# EAGLE design Thinkpad380ED (EAGLE 9.5.0)
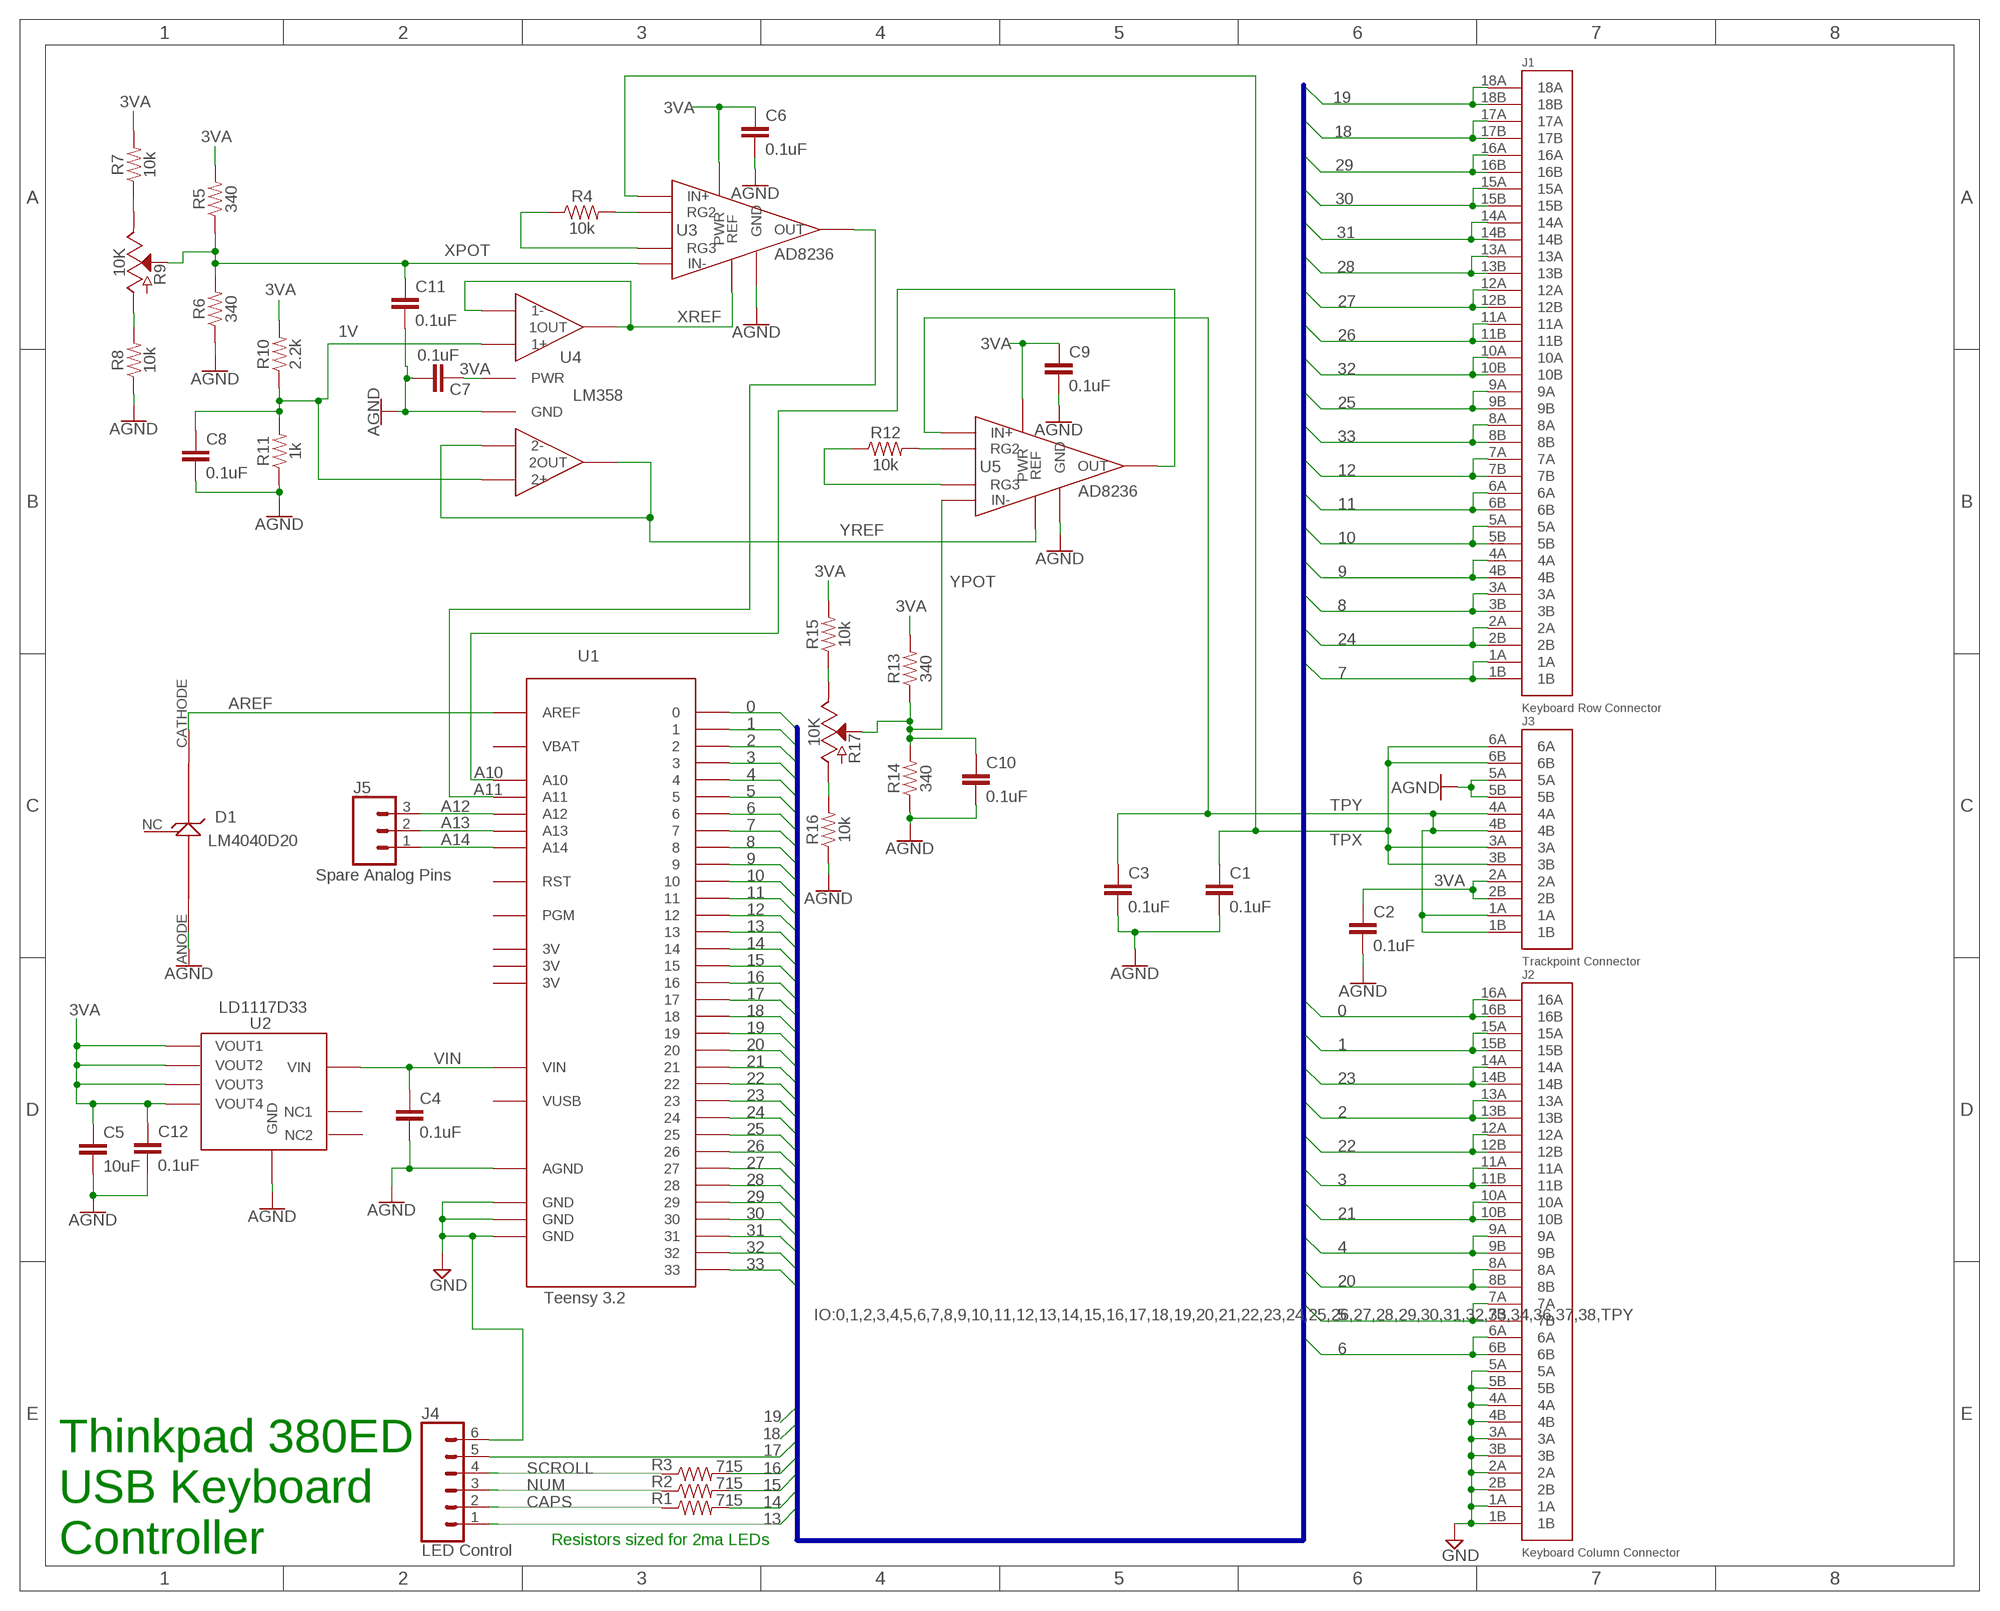
[diagram p0: schematic, sheet 1]

## Parts
C1  0.1uF  0.1UF-0603-25V-(+80/-20%)  [0603]
C2  0.1uF  0.1UF-0603-25V-(+80/-20%)  [0603]
C3  0.1uF  0.1UF-0603-25V-(+80/-20%)  [0603]
C4  0.1uF  0.1UF-0603-25V-(+80/-20%)  [0603]
C5  10uF  10UF-0603-6.3V-20%  [0603]
C6  0.1uF  0.1UF-0603-25V-(+80/-20%)  [0603]
C7  0.1uF  0.1UF-0603-25V-(+80/-20%)  [0603]
C8  0.1uF  0.1UF-0603-25V-(+80/-20%)  [0603]
C9  0.1uF  0.1UF-0603-25V-(+80/-20%)  [0603]
C10  0.1uF  0.1UF-0603-25V-(+80/-20%)  [0603]
C11  0.1uF  0.1UF-0603-25V-(+80/-20%)  [0603]
C12  0.1uF  0.1UF-0603-25V-(+80/-20%)  [0603]
D1  LM4040D20  LM4040  [LM4040]
J1  Keyboard Row Connector  0526101833  [0526101833]
J2  Keyboard Column Connector  0526101633  [0526101633]
J3  Trackpoint Connector  0526100633  [0526100633]
J4  LED Control  CONN_06SILK_FEMALE_PTH  [1X06]
J5  Spare Analog Pins  CONN_03  [1X03]
R1  715  715OHM-0603-1/10W-1%  [0603]
R2  715  715OHM-0603-1/10W-1%  [0603]
R3  715  715OHM-0603-1/10W-1%  [0603]
R4  10k  10KOHM-0603-1/10W-1%  [0603]
R5  340  340OHM-0603-1/10W-1%  [0603]
R6  340  340OHM-0603-1/10W-1%  [0603]
R7  10k  10KOHM-0603-1/10W-1%  [0603]
R8  10k  10KOHM-0603-1/10W-1%  [0603]
R9  10K  3296W-1-103LF  [3296W-1-103LF]
R10  2.2k  2.2KOHM-0603-1/10W-1%  [0603]
R11  1k  1KOHM-0603-1/10W-1%  [0603]
R12  10k  10KOHM-0603-1/10W-1%  [0603]
R13  340  340OHM-0603-1/10W-1%  [0603]
R14  340  340OHM-0603-1/10W-1%  [0603]
R15  10k  10KOHM-0603-1/10W-1%  [0603]
R16  10k  10KOHM-0603-1/10W-1%  [0603]
R17  10K  3296W-1-103LF  [3296W-1-103LF]
U1  Teensy 3.2  TEENSY_3P2  [TEENSY_3P2]
U2  LD1117D33  LD1117D33CTR  [LD1117D33CTR]
U3  AD8236  [AD8236]
U4  LM358  LM358D  [LM358D]
U5  AD8236  [AD8236]

## Nets
0: J2.16A J2.16B U1.0
1: J2.15A J2.15B U1.1
1V: C8.1 R10.1 R11.2 U4.IN1+(1+) U4.IN2+(2+)
2: J2.13A J2.13B U1.2
3: J2.11A J2.11B U1.3
3VA: C2.1 C5.1 C6.1 C7.1 C9.1 C12.1 J3.2A J3.2B R5.2 R7.2 R10.2 R13.2 R15.2 U2.VOUT1 U2.VOUT2 U2.VOUT3 U2.VOUT4 U3.PWR U4.PWR U5.PWR
4: J2.9A J2.9B U1.4
5: J2.7A J2.7B U1.5
6: J2.6A J2.6B U1.6
7: J1.1A J1.1B U1.7
8: J1.3A J1.3B U1.8
9: J1.4A J1.4B U1.9
10: J1.5A J1.5B U1.10
11: J1.6A J1.6B U1.11
12: J1.7A J1.7B U1.12
13: J4.1 U1.13
14: R1.2 U1.14
15: R2.2 U1.15
16: R3.2 U1.16
17: J4.5 U1.17
18: J1.17A J1.17B U1.18
19: J1.18A J1.18B U1.19
20: J2.8A J2.8B U1.20
21: J2.10A J2.10B U1.21
22: J2.12A J2.12B U1.22
23: J2.14A J2.14B U1.23
24: J1.2A J1.2B U1.24
25: J1.9A J1.9B U1.25
26: J1.11A J1.11B U1.26
27: J1.12A J1.12B U1.27
28: J1.13A J1.13B U1.28
29: J1.16A J1.16B U1.29
30: J1.15A J1.15B U1.30
31: J1.14A J1.14B U1.31
32: J1.10A J1.10B U1.32
33: J1.8A J1.8B U1.33
A10: U1.A10 U5.VOUT(OUT)
A11: U1.A11 U3.VOUT(OUT)
A12: J5.3 U1.A12
A13: J5.2 U1.A13
A14: J5.1 U1.A14
AGND: C1.2 C2.2 C3.2 C4.2 C5.2 C6.2 C7.2 C8.2 C9.2 C10.2 C11.2 C12.2 D1.ANODE J3.5A J3.5B R6.1 R8.1 R11.1 R14.1 R16.1 U1.AGND U2.GND U3.GND U4.GND U5.GND
AREF: D1.CATHODE U1.AREF
CAPS: J4.2 R1.1
GND: J2.1A J2.1B J2.2A J2.2B J2.3A J2.3B J2.4A J2.4B J2.5A J2.5B J4.6 U1.GND1(GND) U1.GND2(GND) U1.GND3(GND)
N$1: R4.2 U3.RG2
N$4: R4.1 U3.RG3
N$7: R8.2 R9.A
N$9: R7.1 R9.E
N$14: R12.2 U5.RG2
N$15: R12.1 U5.RG3
N$18: R16.2 R17.A
N$19: R15.1 R17.E
NUM: J4.3 R2.1
SCROLL: J4.4 R3.1
TPX: C1.1 J3.3A J3.3B J3.6A J3.6B U3.IN+
TPY: C3.1 J3.1A J3.1B J3.4A J3.4B U5.IN+
VIN: C4.1 U1.VIN U2.VIN
XPOT: C11.1 R5.1 R6.2 R9.S U3.IN-
XREF: U3.REF U4.IN1-(1-) U4.OUT1(1OUT)
YPOT: C10.1 R13.1 R14.2 R17.S U5.IN-
YREF: U4.IN2-(2-) U4.OUT2(2OUT) U5.REF
Unconnected: D1.NC U1.3V1(3V) U1.3V2(3V) U1.3V3(3V) U1.PGM U1.RST U1.VBAT U1.VUSB U2.NC1 U2.NC2

## Buses
IO:0,1,2,3,4,5,6,7,8,9,10,11,12,13,14,15,16,17,18,19,20,21,22,23,24,25,26,27,28,29,30,31,32,33,34,36,37,38,TPY

## Notes on the sheet
- Resistors sized for 2ma LEDs
- Thinkpad 380ED 
  USB Keyboard 
  Controller

## Library data of the parts
C1-C4 C6-C12 = SparkFun-Capacitors:0.1UF: 0.1µF ceramic capacitors A capacitor is a passive two-terminal electrical component used to store electrical energy temporarily in an electric field.; PROD_ID: CAP-00810
C5 = SparkFun-Capacitors:10UF: 10.0µF ceramic capacitors A capacitor is a passive two-terminal electrical component used to store electrical energy temporarily in an electric field.; PROD_ID: CAP-11015
D1 = LM4040:LM4040
J1 = 0526101833:0526101833
J2 = 0526101633:0526101633
J3 = 0526100633:0526100633
J4 = SparkFun-Connectors:CONN_06: Multi connection point. Often used as Generic Header-pin footprint for 0.1 inch spaced/style header connections On any of the 0.1 inch spaced packages, you can populate with these: Break Away Headers - Straight <https://www.sparkfun.com/products/116> (PRT-00116) Break Away Male Headers - Right Angle <https://www.sparkfun.com/products/553> (PRT-00553) Female Headers <https://www.sparkfun.com/products/115> (PRT-00115) Break Away Headers - Machine Pin <https://www.sparkfun.com/products/117> (PRT-00117) Break Away Female Headers - Swiss Machine Pin <https://www.sparkfun.com/products/743> (PRT-00743) Arduino Stackable Header - 6 Pin <https://www.sparkfun.com/products/9280> (PRT-09280) For SCREWTERMINALS and SPRING TERMINALS visit here: Screw Terimnals on SparkFun.com <https://www.sparkfun.com/search/results?term=Screw+Terminals> (5mm/3.5mm/2.54mm spacing) This device is also useful as a general connection point to wire up your design to another part of your project. Our various solder wires solder well into these plated through hole pads. Hook-Up Wire - Assortment (Stranded, 22 AWG) <https://www.sparkfun.com/products/11375> (PRT-11375) Hook-Up Wire - Assortment (Solid Core, 22 AWG) <https://www.sparkfun.com/products/11367> (PRT-11367) View the entire wire category on our website here <https://www.sparkfun.com/categories/141>; PROD_ID: CONN-08437
J5 = SparkFun-Connectors:CONN_03: Multi connection point. Often used as Generic Header-pin footprint for 0.1 inch spaced/style header connections On any of the 0.1 inch spaced packages, you can populate with these: Break Away Headers - Straight <https://www.sparkfun.com/products/116> (PRT-00116) Break Away Male Headers - Right Angle <https://www.sparkfun.com/products/553> (PRT-00553) Female Headers <https://www.sparkfun.com/products/115> (PRT-00115) Break Away Headers - Machine Pin <https://www.sparkfun.com/products/117> (PRT-00117) Break Away Female Headers - Swiss Machine Pin <https://www.sparkfun.com/products/743> (PRT-00743) Stackable Header - 3 Pin (Female, 0.1") <https://www.sparkfun.com/products/13875> (PRT-13875) For SCREWTERMINALS and SPRING TERMINALS visit here: Screw Terimnals on SparkFun.com <https://www.sparkfun.com/search/results?term=Screw+Terminals> (5mm/3.5mm/2.54mm spacing) This device is also useful as a general connection point to wire up your design to another part of your project. Our various solder wires solder well into these plated through hole pads. Hook-Up Wire - Assortment (Stranded, 22 AWG) <https://www.sparkfun.com/products/11375> (PRT-11375) Hook-Up Wire - Assortment (Solid Core, 22 AWG) <https://www.sparkfun.com/products/11367> (PRT-11367) View the entire wire category on our website here <https://www.sparkfun.com/categories/141> Special notes: Molex polarized connector foot print use with SKU : PRT-08232 with associated crimp pins and housings.; PROD_ID: XXX-00000; VALUE: 455-1750-1-ND
R1-R3 = SparkFun-Resistors:715OHM: 715Ω resistor A resistor is a passive two-terminal electrical component that implements electrical resistance as a circuit element. Resistors act to reduce current flow, and, at the same time, act to lower voltage levels within circuits. - Wikipedia; PROD_ID: RES-07850
R4 R7 R8 R12 R15 R16 = SparkFun-Resistors:10KOHM: 10kΩ resistor A resistor is a passive two-terminal electrical component that implements electrical resistance as a circuit element. Resistors act to reduce current flow, and, at the same time, act to lower voltage levels within circuits. - Wikipedia; PROD_ID: RES-00824
R5 R6 R13 R14 = SparkFun-Resistors:340OHM: 340Ω resistor A resistor is a passive two-terminal electrical component that implements electrical resistance as a circuit element. Resistors act to reduce current flow, and, at the same time, act to lower voltage levels within circuits. - Wikipedia; PROD_ID: RES-12616
R9 R17 = 3296W-1-103LF:3296W-1-103LF
R10 = SparkFun-Resistors:2.2KOHM: 2.2kΩ resistor A resistor is a passive two-terminal electrical component that implements electrical resistance as a circuit element. Resistors act to reduce current flow, and, at the same time, act to lower voltage levels within circuits. - Wikipedia; PROD_ID: RES-08272
R11 = SparkFun-Resistors:1KOHM: 1kΩ resistor A resistor is a passive two-terminal electrical component that implements electrical resistance as a circuit element. Resistors act to reduce current flow, and, at the same time, act to lower voltage levels within circuits. - Wikipedia; PROD_ID: RES-07856
U1 = Teensy_3p2_PCG:TEENSY_3P2: Teensy 3.2 - Microcontroller Technical Specifications: VCC: 3.3V signals, 5V tolerant 72 MHz Cortex-M4 32 bit ARM Processor 100% Compatible with Teensy 3.1 pjrc.com/store/teensy32.html
U2 = LD1117D33CTR:LD1117D33CTR
U3 U5 = AD8236:AD8236
U4 = LM358D:LM358D

## Board
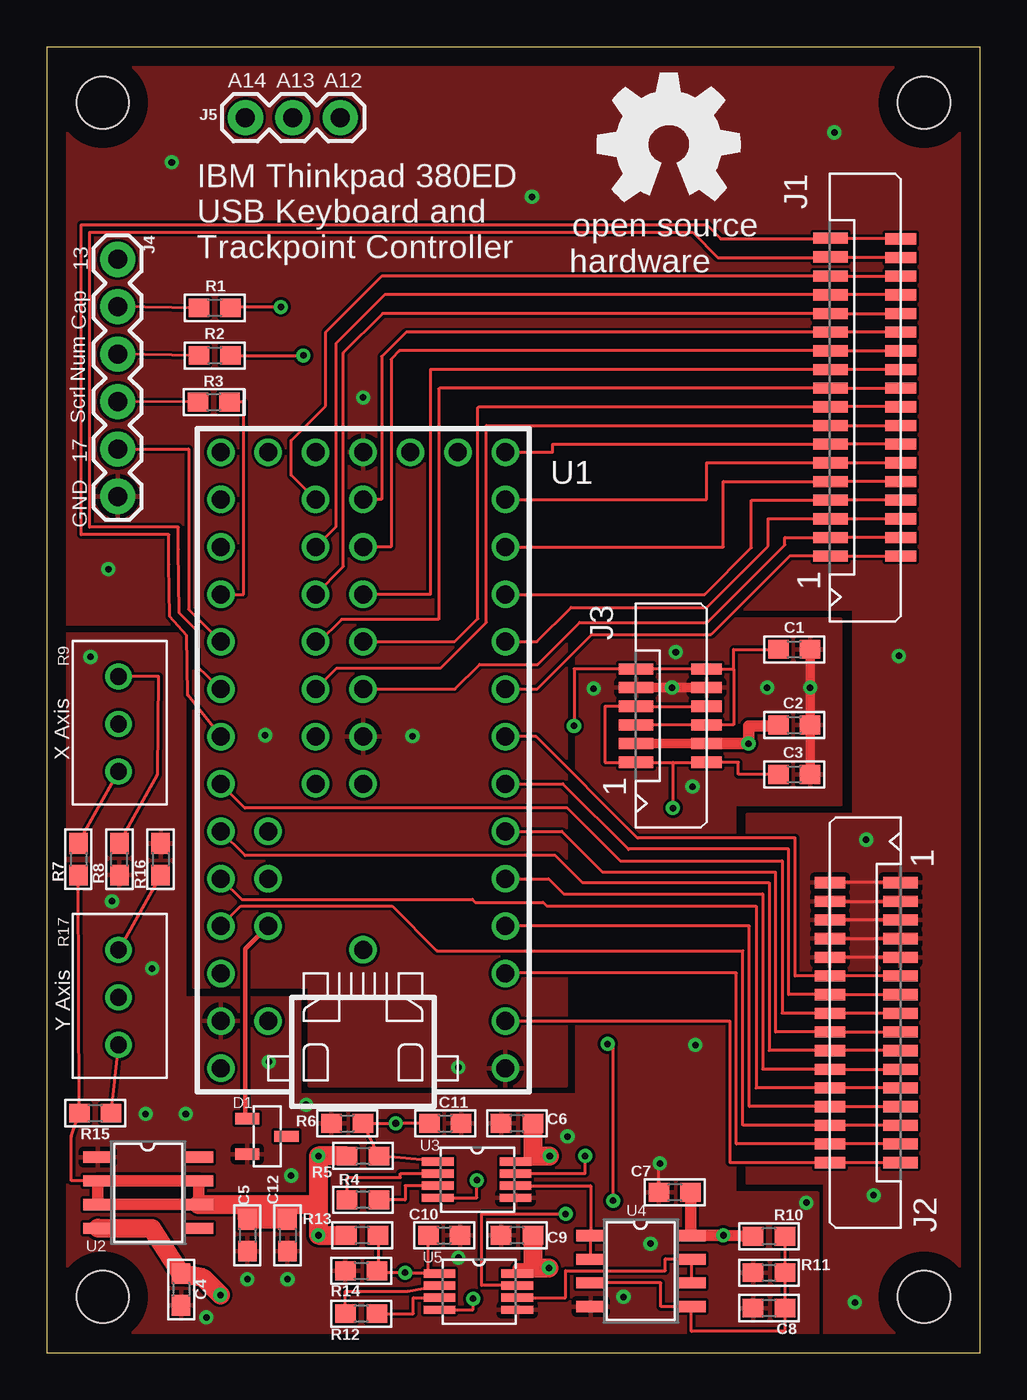
[diagram p1: board, top side]
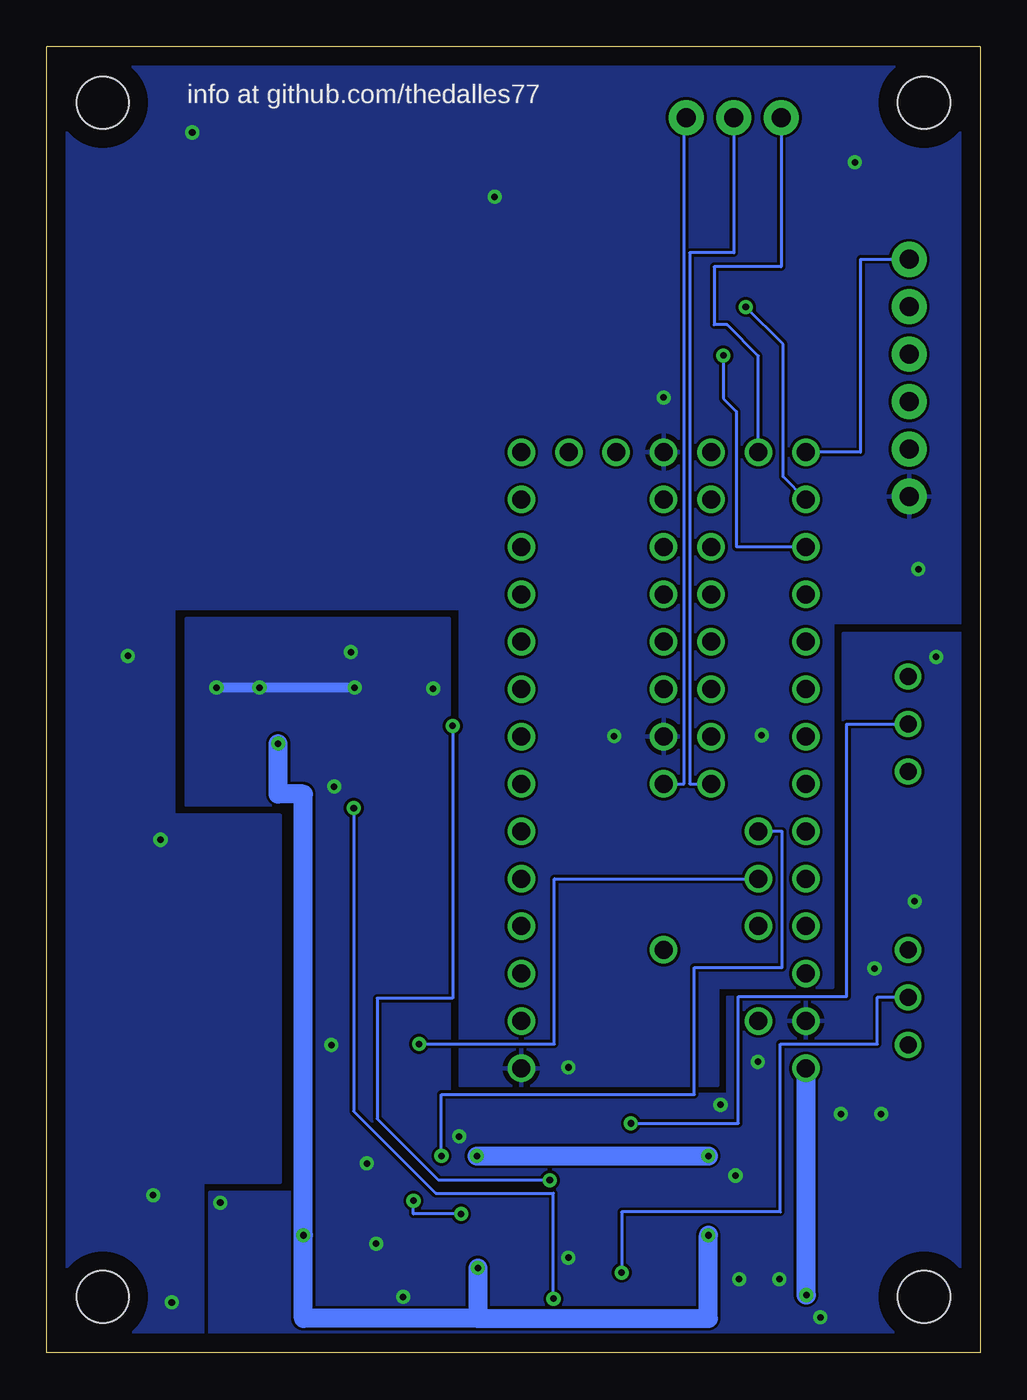
[diagram p2: board, bottom side, seen from below]

Size 50 x 70 mm. Coordinates in mm from the lower left corner, seen from the top.
Outline: 0,0 50,0 50,70 0,70 0,0
Copper layers (1*16): Top 0.035mm / dielectric 1.5mm / Bottom 0.035mm
Design rules "default": minimum track width 6mil, minimum drill 0.35mm, track to track 6mil, track to pad 6mil, pad to pad 6mil, via to via 6mil, smd to smd 6mil, copper to edge 40mil, drill to drill 6mil, minimum pad ring 10mil, minimum via ring 8mil, stop-mask expansion 4mil, vias tented up to drill 0mil, thermal gap 10mil
Holes 2.8 mm at 3,3 47,3 47,67 3,67

### Footprints (pad centres in the part's own frame; a part is rotated, then mirrored left to right if it is on the bottom)
0603 = smd 1.1 x 1: 1 -0.85,0; 2 0.85,0
LM4040 = smd 1.3 x 0.6: ANODE -1.1,-0.95; CATHODE -1.1,0.95; NC 1,0
0526101833 = smd 0.6 x 1.65: 1A 0,0; 2A 1,0; 3A 2,0; 4A 3,0; 5A 4,0; 6A 5,0; 7A 6,0; 8A 7,0; 9A 8,0; 10A 9,0; 11A 10,0; 12A 11,0; 13A 12,0; 14A 13,0; 15A 14,0; 16A 15,0; 17A 16,0; 18A 17,0 | smd 0.6 x 1.85: 1B 0,3.77; 2B 1,3.77; 3B 2,3.77; 4B 3,3.77; 5B 4,3.77; 6B 5,3.77; 7B 6,3.77; 8B 7,3.77; 9B 8,3.77; 10B 9,3.77; 11B 10,3.77; 12B 11,3.77; 13B 12,3.77; 14B 13,3.77; 15B 14,3.77; 16B 15,3.77; 17B 16.03,3.76; 18B 17.03,3.76
0526101633 = smd 0.6 x 1.65: 1A 0,0; 2A 1,0; 3A 2,0; 4A 3,0; 5A 4,0; 6A 5,0; 7A 6,0; 8A 7,0; 9A 8,0; 10A 9,0; 11A 10,0; 12A 11,0; 13A 12,0; 14A 13,0; 15A 14,0; 16A 15,0 | smd 0.6 x 1.85: 1B 0,3.77; 2B 1,3.77; 3B 2,3.77; 4B 3,3.77; 5B 4,3.77; 6B 5,3.77; 7B 6,3.77; 8B 7,3.77; 9B 8,3.77; 10B 9,3.77; 11B 10,3.77; 12B 11,3.77; 13B 12,3.77; 14B 13,3.77; 15B 14,3.77; 16B 15,3.77
0526100633 = smd 0.6 x 1.65: 1A 0,0; 2A 1,0; 3A 2,0; 4A 3,0; 5A 4,0; 6A 5,0 | smd 0.6 x 1.85: 1B 0,3.77; 2B 1,3.77; 3B 2,3.77; 4B 3,3.77; 5B 4,3.77; 6B 5,3.77
1X06 = drill 1.016 pad 1.88: 1 0,0; 2 2.54,0; 3 5.08,0; 4 7.62,0; 5 10.16,0; 6 12.7,0
1X03 = drill 1.016 pad 1.88: 1 0,0; 2 2.54,0; 3 5.08,0
3296W-1-103LF = drill 0.9: A 0,2.54; E 0,-2.54; S 0,0
TEENSY_3P2 = drill 0.965: 0 -10.16,-7.62; 1 -7.62,-7.62; 2 -5.08,-7.62; 3 -2.54,-7.62; 3V1 -7.62,7.62; 3V2 20.32,-2.54; 3V3 5.08,2.54; 4 0,-7.62; 5 2.54,-7.62; 6 5.08,-7.62; 7 7.62,-7.62; 8 10.16,-7.62; 9 12.7,-7.62; 10 15.24,-7.62; 11 17.78,-7.62; 12 20.32,-7.62; 13 20.32,7.62; 14 17.78,7.62; 15 15.24,7.62; 16 12.7,7.62; 17 10.16,7.62; 18 7.62,7.62; 19 5.08,7.62; 20 2.54,7.62; 21 0,7.62; 22 -2.54,7.62; 23 -5.08,7.62; 24 7.62,0; 25 10.16,0; 26 12.7,0; 27 15.24,0; 28 17.78,0; 29 17.78,2.54; 30 15.24,2.54; 31 12.7,2.54; 32 10.16,2.54; 33 7.62,2.54; A10 -2.54,5.08; A11 0,5.08; A12 2.54,0; A13 2.54,2.54; A14 20.32,5.08; AGND -10.16,7.62; AREF -5.08,5.08; GND1 -12.7,-7.62; GND2 20.32,0; GND3 5.08,0; PGM 20.32,2.54; RST -6.35,0; VBAT 20.32,-5.08; VIN -12.7,7.62; VUSB -10.16,5.08
LD1117D33CTR = smd 1.55 x 0.6: GND -2.66,1.84; NC1 2.74,1.84; NC2 2.74,-1.97; VIN -2.66,-1.97; VOUT1 -2.66,0.57; VOUT2 -2.66,-0.7; VOUT3 2.74,0.57; VOUT4 2.74,-0.7
AD8236 = smd 1.7 x 0.45: GND 2.06,-0.99; IN+ -2.1,-0.99; IN- -2.1,0.96; PWR 2.06,0.96; REF 2.06,-0.34; RG2 -2.1,0.31; RG3 -2.1,-0.34; VOUT 2.06,0.31
LM358D = smd 1.55 x 0.6: GND -2.66,-1.97; IN1+ -2.66,-0.7; IN1- -2.66,0.57; IN2+ 2.74,-1.97; IN2- 2.74,-0.7; OUT1 -2.66,1.84; OUT2 2.74,0.57; PWR 2.74,1.84

### Placement (x,y rotation side)
C1  40.05,37.7 0 top
C2  40.05,33.65 0 top
C3  40.05,31 0 top
C4  7.2,3.4 270 top
C5  10.75,6.3 270 top
C6  25.2,12.3 180 top
C7  33.65,8.6 180 top
C8  38.7,2.4 180 top
C9  25.2,6.3 180 top
C10  21.3,6.3 0 top
C11  21.35,12.3 0 top
C12  12.9,6.3 270 top
D1  11.85,11.6 0 top
J1  45.75,42.7 90 top
J2  41.96,25.2 270 top
J3  35.35,31.65 90 top
J4  3.8,58.6 270 top
J5  10.65,66.2 0 top
R1  9,56 0 top
R2  9,53.45 0 top
R3  8.95,50.95 0 top
R4  16.95,8.2 180 top
R5  16.95,10.55 180 top
R6  16.1,12.3 0 top
R7  1.7,26.45 270 top
R8  3.9,26.45 90 top
R9  3.85,33.7 0 top
R10  38.7,6.25 180 top
R11  38.7,4.3 0 top
R12  16.85,2.1 180 top
R13  16.9,6.3 180 top
R14  16.85,4.4 0 top
R15  2.6,12.85 180 top
R16  6.1,26.45 270 top
R17  3.85,19.05 0 top
U1  16.95,27.95 90 top
U2  5.4,8.65 0 top
U3  23.05,9.3 0 top
U4  31.8,4.45 0 top
U5  23.15,3.3 0 top
U$1  [OSHW_8MM]  33.3,64.75 0 top

### Tracks (layer width: path | path; a pad name or v marks a point on that pad's centre or on a via)
0
  Top 0.152: J2.16B J2.16A 36.6,10.2 36.6,17.79 U1.0
1
  Top 0.152: J2.15B J2.15A 36.95,11.2 36.95,20.35 24.57,20.35 U1.1
1V
  Top 0.152: R10.1 R11.2 C8.1 39.55,1.15 34.54,1.15 U4.IN2+ 32.9,2.48 32.9,3.75 U4.IN1+
2
  Top 0.152: J2.13B J2.13A 37.65,13.2 37.65,22.87 U1.2
3
  Top 0.152: J2.11B J2.11A 38.35,15.2 38.35,24.6 27.7,24.6 26.89,25.41 U1.3
3VA  (via drill 0.35)
  Top 0.152: U2.VOUT1 1.32,9.22 1.32,11.6 R15.2 R7.2 | U3.PWR v26.95,10.55 | U4.PWR 34.5,6.29
  Top 0.508: J3.2B J3.2A | U5.PWR 25.21,4.55 v26.9,4.55
  Top 0.61: U4.PWR v36.25,6.3 R10.2 | 34.5,6.29 C7.1 | J3.2A v37.6,32.65 37.6,33.6 39.2,33.6 C2.1 | U2.VOUT2 U2.VOUT4 U2.VOUT3 U2.VOUT1 U2.VOUT2
  Top 1.016: R5.2 v14.55,10.55 14.55,7.95 | 14.55,7.95 v14.55,6.3 R13.2 | U2.VOUT4 10.75,7.95 | 10.75,7.95 14.55,7.95 | C12.1 C5.1 10.75,7.95 | C9.1 26.05,4.55 v26.9,4.55 | C6.1 26.05,10.55 v26.95,10.55
  Bottom 1.016: v26.9,4.55 26.9,1.85 | v14.55,6.3 14.55,1.85 26.9,1.85 | 26.9,1.85 36.25,1.85 v36.25,6.3 36.25,29.95 37.6,29.95 v37.6,32.65 | v26.95,10.55 v14.55,10.55
4
  Top 0.152: J2.9B J2.9A 39.05,17.2 39.05,25.75 29.8,25.75 27.6,27.95 U1.4
5
  Top 0.152: J2.7B J2.7A 39.75,19.2 39.75,27 31.18,27 31.18,26.98 27.66,30.49 U1.5
6
  Top 0.152: J2.6B J2.6A 40.1,20.2 40.1,27.6 31.68,27.6 31.68,27.57 26.22,33.03 U1.6
7
  Top 0.152: J1.1A J1.1B 39.8,42.7 35.6,38.5 29.2,38.5 26.27,35.57 U1.7
8
  Top 0.152: J1.3A J1.3B 38.65,44.7 38.65,43.25 35.35,39.95 28.1,39.95 26.26,38.11 U1.8
9
  Top 0.152: J1.4A 42.05,45.7 J1.4B 37.75,45.7 37.75,43.15 35.25,40.65 U1.9
10
  Top 0.152: J1.5A J1.5B 36.25,46.7 36.25,43.2 36.24,43.19 U1.10
11
  Top 0.152: J1.6A J1.6B 35.35,47.7 35.35,45.73 U1.11
12
  Top 0.152: J1.7A J1.7B 27.1,48.7 27.1,48.27 U1.12
13
  Bottom 0.152: U1.13 6.4,48.27 6.4,58.6 J4.1
14  (via drill 0.35)
  Top 0.152: v12.55,56.05 9.9,56.05 R1.2
  Bottom 0.152: U1.14 10.55,46.95 10.55,54.05 v12.55,56.05
15  (via drill 0.35)
  Top 0.152: R2.2 v13.75,53.45
  Bottom 0.152: U1.15 13.05,43.19 13.05,50.45 13.75,51.15 v13.75,53.45
16
  Top 0.152: U1.16 10.55,40.65 10.55,50.95 R3.2
17
  Top 0.152: U1.17 7.6,39.84 7.6,48.44 J4.5
18
  Top 0.152: U1.18 8.05,36.8 8,38.75 7.11,39.64 7.06,43.06 7.06,44.25 2.3,44.25 2.3,60.05 34.6,60.05 35.95,58.7 41.99,58.7 | J1.17A 41.99,58.7 | 41.99,58.7 J1.17B
19
  Top 0.152: U1.19 7.55,35.25 7.5,38.45 6.6,39.45 6.55,42.25 6.55,43.85 1.85,43.85 1.85,60.45 35.35,60.45 36.1,59.7 41.99,59.7 | J1.18A 41.99,59.7 | 41.99,59.7 J1.18B
20
  Top 0.152: J2.8B J2.8A 39.4,18.2 39.4,26.38 30.73,26.38 27.9,29.2 10.62,29.2 U1.20
21
  Top 0.152: J2.10B J2.10A 38.7,16.2 38.7,25.2 28.7,25.2 27.25,26.65 10.63,26.65 U1.21
22
  Top 0.152: J2.12B J2.12A 38,14.2 38,23.95 26.8,23.95 26.6,24.15 22.95,24.15 22.8,24.3 10.44,24.3 U1.22
23
  Top 0.152: J2.14B J2.14A 37.3,12.2 37.3,21.55 20.9,21.55 18.5,23.95 10.41,23.95 U1.23
24
  Top 0.152: J1.2A J1.2B 39.55,43.7 39.55,43.3 35.4,39.15 28.55,39.15 26.3,36.9 23.2,36.9 21.87,35.57 U1.24
25
  Top 0.152: J1.9A J1.9B 23.15,50.7 23.1,50.65 23.1,39.35 21.86,38.11 U1.25
26
  Top 0.152: J1.11A J1.11B 20.55,52.7 20.55,40.65 U1.26
27
  Top 0.152: J1.12A J1.12B 18.9,53.7 18.45,53.25 18.45,43.2 18.44,43.19 U1.27
28
  Top 0.152: U1.28 17.93,45.73 17.95,45.75 17.95,53.4 19.25,54.7 J1.13B J1.13A
29
  Top 0.152: U1.29 13.1,47.04 13.1,48.9 14.95,50.75 14.95,54.7 17.95,57.7 J1.16B J1.16A
30
  Top 0.152: U1.30 15.5,44.28 15.5,54.1 18.1,56.7 J1.15B J1.15A
31
  Top 0.152: U1.31 15.9,42.14 15.9,53.6 18,55.7 J1.14B J1.14A
32
  Top 0.152: J1.10A J1.10B 21.05,51.7 21,51.65 21,39.3 15.8,39.3 14.61,38.11 U1.32
33
  Top 0.152: J1.8A 42.1,49.7 J1.8B 23.55,49.7 23.55,39.15 21.1,36.7 15.54,36.7 U1.33
A10  (via drill 0.35)
  Top 0.152: U5.VOUT 23.3,3.61 23.3,7.45 v27.8,7.45 | v30.35,8.15 30.35,16.55 v30.05,16.55
  Bottom 0.152: v30.05,16.55 22.8,16.55 22.8,25.41 U1.A10 | v30.35,8.15 30.35,7.45 v27.8,7.45
A11  (via drill 0.35)
  Top 0.152: U3.VOUT 28.85,9.61 v28.85,10.55
  Bottom 0.152: v28.85,10.55 28.85,13.85 15.3,13.85 15.3,20.65 10.6,20.65 10.6,27.95 U1.A11
A12
  Bottom 0.152: U1.A12 15.86,30.49 15.86,66.2 J5.3
A13
  Bottom 0.152: J5.2 13.19,58.95 15.55,58.95 15.55,30.49 U1.A13
A14
  Bottom 0.152: U1.A14 11.87,53.42 13.55,55.1 14.25,55.1 14.25,58.2 10.65,58.2 J5.1
AGND  (via drill 0.35)
  Top 0.152: C7.2 32.8,10.15 v32.85,10.15
  Top 0.508: J3.5B v33.5,35.65 J3.5A | C1.2 v40.9,35.65 C2.2 C3.2
  Bottom 0.508: v33.5,35.65 v40.9,35.65
  other vias: 34.6,30.35 38.6,35.65 29.3,35.6 33.7,37.55 34.75,16.5 40.7,8.05 30.9,3 32.35,5.85 10.75,3.95 12.9,3.95 13.1,9.5 27.9,11.6 11.9,15.6 3.5,24.2 7.45,12.8 5.3,12.8 8.55,1.9 5.65,20.6 22.05,5.1 13.9,13.3 2.35,37.3
  pour Top: 0,0 0,38.55 7.4,38.55 7.4,19.05 13.55,19.05 13.55,13.85 28.4,13.85 28.4,39.35 42.55,39.35 42.55,29.35 36.85,29.35 36.85,8.6 41.3,8.6 41.3,0
  pour Bottom: 0,0 0,38.55 7.35,38.55 7.35,19.05 13.55,19.05 13.55,13.85 28.4,13.85 28.4,39.35 42.55,39.35 42.55,29.35 36.85,29.35 36.85,8.6 41.3,8.6 41.3,0
AREF
  Top 0.254: U1.AREF 10.65,21.65 10.65,12.65 D1.CATHODE
CAPS
  Top 0.152: R1.1 J4.2
GND  (via drill 0.35)
  Top 0.152: J2.1B J2.1A | J2.2A J2.2B | J2.3B J2.3A | J2.4A J2.4B | J2.5B J2.5A
  other vias: 6.7,63.8 26,61.95 42.2,65.4 16.95,51.2 43.9,27.5 43.3,2.7 44.3,8.45 3.3,42 19.6,33.05 11.7,33.1 45.65,37.35 22.05,15.3
  pour Bottom: 41.65,0 49.95,0 49.95,69.95 0.05,69.95 0.05,39.1 7.9,39.1 7.9,19.55 14.05,19.55 14.05,14.3 27.85,14.3 27.85,39.85 43.2,39.85 43.2,28.85 37.5,28.85 37.5,9.1 41.65,9.1
  pour Top: 41.65,0 50,0 50,70 0.1,70 0.1,39.05 7.85,39.05 7.85,19.6 14.05,19.6 14.05,14.3 27.85,14.3 27.85,39.85 43.2,39.85 43.2,28.85 37.5,28.85 37.5,9.1 41.65,9.1
N$1
  Top 0.152: R4.2 16.1,9.4 18.95,9.4 18.95,9.61 U3.RG2
N$4
  Top 0.152: U3.RG3 19.2,8.96 19.2,8.2 R4.1
N$7
  Top 0.152: R8.2 5.95,31 6,36.25 R9.A
N$9
  Top 0.152: R7.1 R9.E
N$14
  Top 0.152: R12.2 16,3.3 19.35,3.3 U5.RG2
N$15
  Top 0.152: R12.1 19.65,2.1 19.65,2.96 U5.RG3
N$18
  Top 0.152: R16.2 R17.A
N$19
  Top 0.152: R15.1 R17.E
NUM
  Top 0.152: R2.1 J4.3
SCROLL
  Top 0.152: R3.1 J4.4
TPX  (via drill 0.35)
  Top 0.152: J3.3B J3.3A 36.8,33.65 36.8,36.65 | 36.8,36.65 J3.6A J3.6B 28.25,36.65 v28.25,33.6 | 36.8,36.65 36.8,37.7 C1.1 | U3.IN+ 23.04,8.31 23.05,8.31 v23.05,9.25
  Bottom 0.152: v23.05,9.25 29,9.25 32.3,12.55 32.3,19 28.25,19 v28.25,33.6
TPY  (via drill 0.35)
  Top 0.152: 33.55,31.65 J3.1B 29.9,31.65 29.9,34.65 J3.4B J3.4A | 33.55,31.65 J3.1A 37.05,31.65 37.05,31 C3.1 | U5.IN+ 22.85,2.31 v22.85,2.9 | 33.55,31.65 v33.55,29.2
  Bottom 0.152: v22.85,2.9 22.85,8.55 29.15,8.55 33.55,12.95 v33.55,29.2
VIN  (via drill 0.35)
  Top 1.016: v9.3,3.1 8.38,4.02 C4.1 5.65,6.65 U2.VIN
  Bottom 1.016: U1.VIN 9.33,3.1 v9.3,3.1
XPOT  (via drill 0.35)
  Top 0.152: U3.IN- R5.1 R6.2 v18.7,12.3 C11.1
  Bottom 0.152: v18.7,12.3 12.95,12.3 12.95,19.1 7.15,19.1 7.15,33.7 R9.S
XREF
  Top 0.152: U4.IN1- U4.OUT1 29.14,8.96 U3.REF
YPOT  (via drill 0.35)
  Top 0.152: 17.75,4.3 v19.2,4.3 19.2,4.26 U5.IN- 20.45,4.26 C10.1 | R14.2 17.7,4.3 17.75,4.3 | R13.1 17.75,4.3
  Bottom 0.152: R17.S 5.5,19.05 5.5,16.55 10.7,16.55 10.7,7.55 19.2,7.55 v19.2,4.3
YREF
  Top 0.152: U4.IN2- U4.OUT2 34.54,5.05 33.15,5.05 33.15,4.4 27.8,4.4 27.8,2.96 U5.REF

### Text on the board
tPlace: A14 | A13 | A12 | 13 | IBM Thinkpad 380ED / USB Keyboard and / Trackpoint Controller | Cap | Num | Scrl | 17 | GND | X Axis | Y Axis
bPlace: info at github.com/thedalles77